# EAGLE schematic M240X (EAGLE 6.6.0)
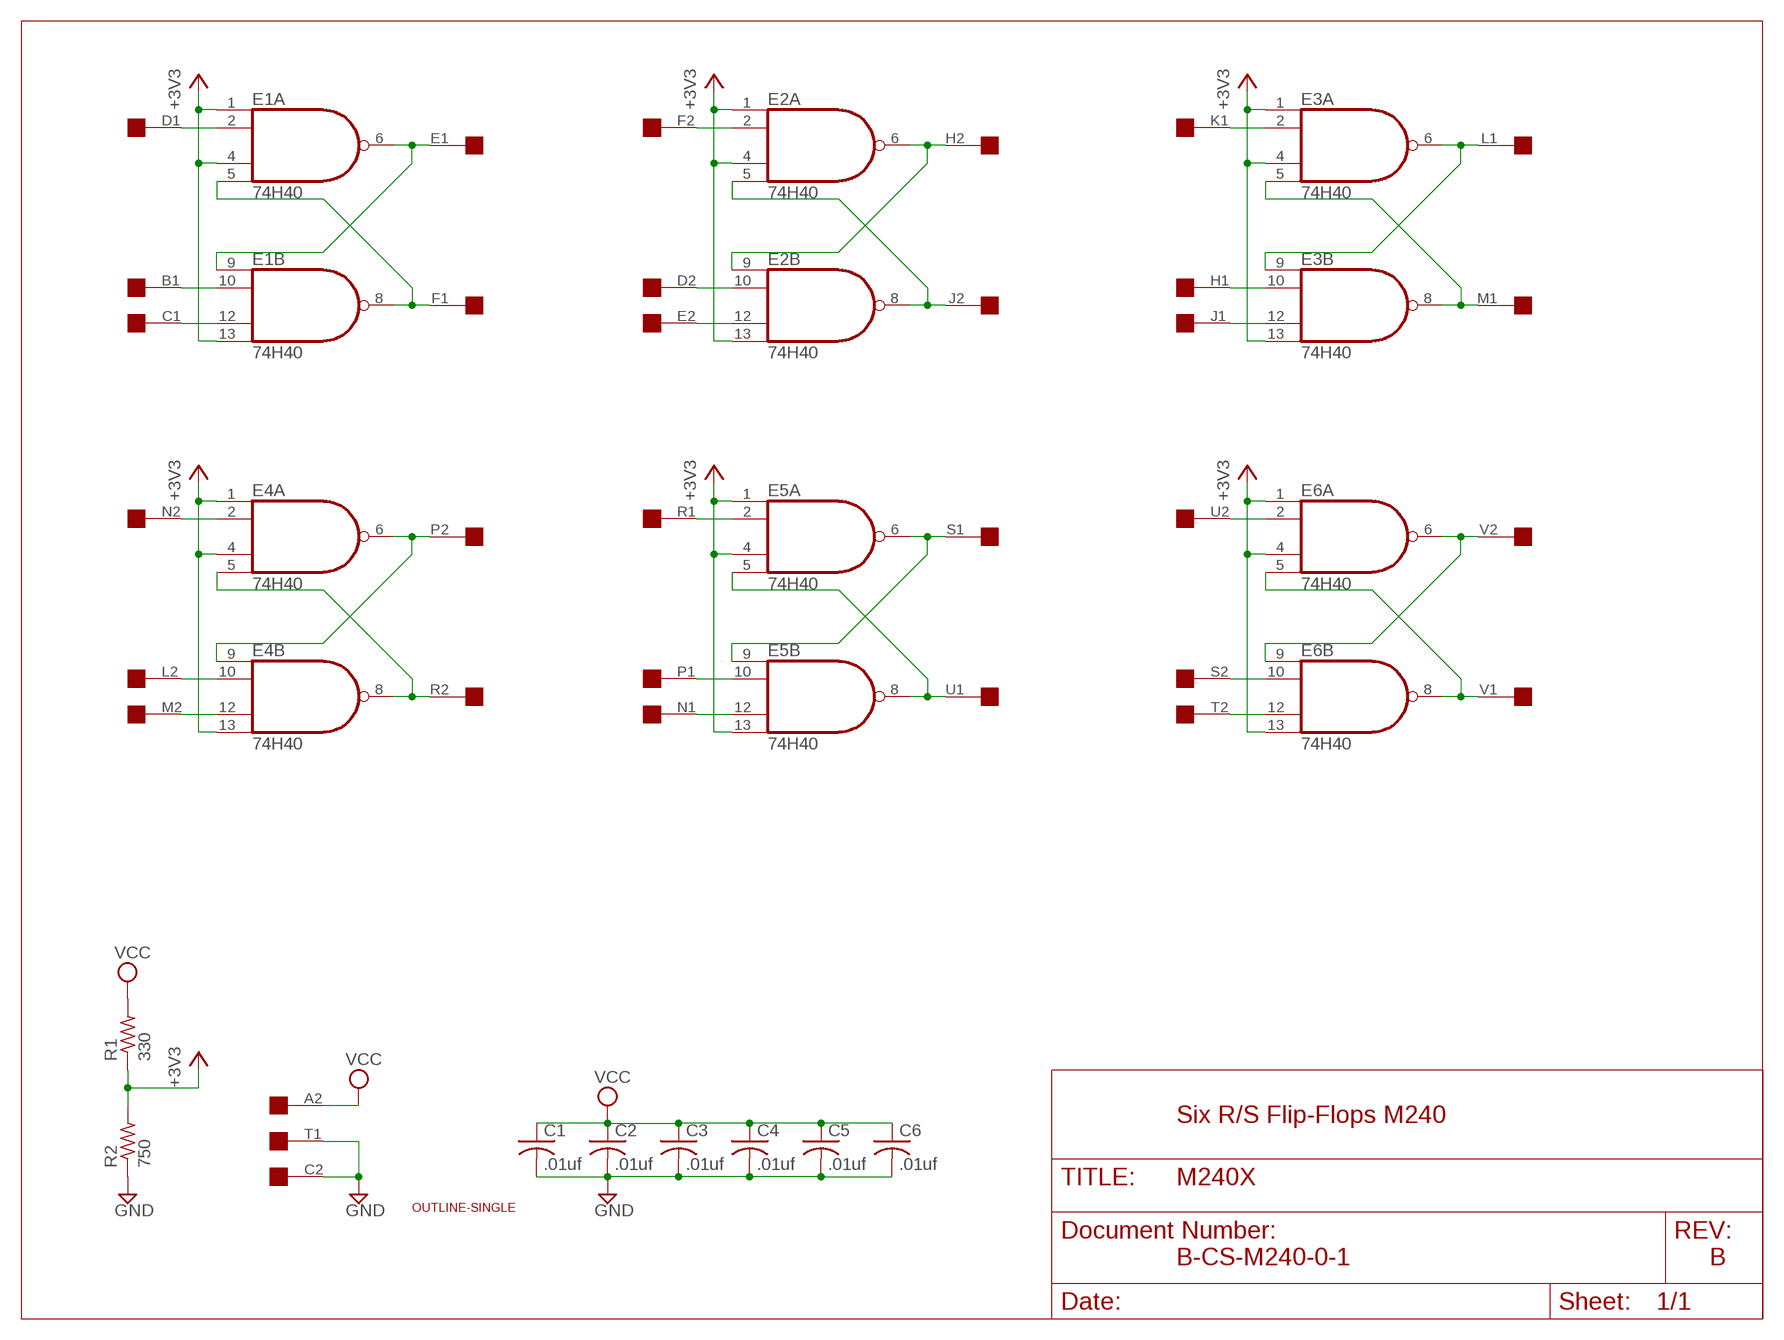
[diagram p0: schematic, sheet 1]

## Parts
C1  .01uf  C-US050-025X075  [C050-025X075]
C2  .01uf  C-US050-025X075  [C050-025X075]
C3  .01uf  C-US050-025X075  [C050-025X075]
C4  .01uf  C-US050-025X075  [C050-025X075]
C5  .01uf  C-US050-025X075  [C050-025X075]
C6  .01uf  C-US050-025X075  [C050-025X075]
E1  74H40  74S20N  [DIL14]
E2  74H40  74S20N  [DIL14]
E3  74H40  74S20N  [DIL14]
E4  74H40  74S20N  [DIL14]
E5  74H40  74S20N  [DIL14]
E6  74H40  74S20N  [DIL14]
R1  330  R-US_0207/10  [0207/10]
R2  750  R-US_0207/10  [0207/10]
U$1  OUTLINE-SINGLE  [SINGLE]
U$4  SINGLE  [EDGE-CON2]

## Nets
+3V3: E1.1(A:I0) E1.4(A:I2) E1.13(B:I3) E2.1(A:I0) E2.4(A:I2) E2.13(B:I3) E3.1(A:I0) E3.4(A:I2) E3.13(B:I3) E4.1(A:I0) E4.4(A:I2) E4.13(B:I3) E5.1(A:I0) E5.4(A:I2) E5.13(B:I3) E6.1(A:I0) E6.4(A:I2) E6.13(B:I3) R1.1 R2.2
GND [Supply]: C1.2 C2.2 C3.2 C4.2 C5.2 C6.2 R2.1 U$4.C2 U$4.T1
N$14: E1.6(A:O) E1.9(B:I0) U$4.E1
N$41: E1.5(A:I3) E1.8(B:O) U$4.F1
N$43: E1.2(A:I1) U$4.D1
N$44: E1.10(B:I1) U$4.B1
N$45: E1.12(B:I2) U$4.C1
N$46: E2.6(A:O) E2.9(B:I0) U$4.H2
N$47: E2.5(A:I3) E2.8(B:O) U$4.J2
N$48: E2.2(A:I1) U$4.F2
N$49: E2.10(B:I1) U$4.D2
N$50: E2.12(B:I2) U$4.E2
N$51: E3.6(A:O) E3.9(B:I0) U$4.L1
N$52: E3.5(A:I3) E3.8(B:O) U$4.M1
N$53: E3.2(A:I1) U$4.K1
N$54: E3.10(B:I1) U$4.H1
N$55: E3.12(B:I2) U$4.J1
N$56: E4.6(A:O) E4.9(B:I0) U$4.P2
N$57: E4.5(A:I3) E4.8(B:O) U$4.R2
N$58: E4.2(A:I1) U$4.N2
N$59: E4.10(B:I1) U$4.L2
N$60: E4.12(B:I2) U$4.M2
N$61: E5.6(A:O) E5.9(B:I0) U$4.S1
N$62: E5.5(A:I3) E5.8(B:O) U$4.U1
N$63: E5.2(A:I1) U$4.R1
N$64: E5.10(B:I1) U$4.P1
N$65: E5.12(B:I2) U$4.N1
N$66: E6.6(A:O) E6.9(B:I0) U$4.V2
N$67: E6.5(A:I3) E6.8(B:O) U$4.V1
N$68: E6.2(A:I1) U$4.U2
N$69: E6.10(B:I1) U$4.S2
N$70: E6.12(B:I2) U$4.T2
VCC [Supply]: C1.1 C2.1 C3.1 C4.1 C5.1 C6.1 R1.2 U$4.A2
Unconnected: U$4.A1 U$4.B2 U$4.K2

## Notes on the sheet
- Six R/S Flip-Flops M240
- B-CS-M240-0-1 | B

## Power pins joined to a net without a drawn wire
GND: E1.7(P:GND) E2.7(P:GND) E3.7(P:GND) E4.7(P:GND) E5.7(P:GND) E6.7(P:GND)
VCC: E1.14(P:VCC) E2.14(P:VCC) E3.14(P:VCC) E4.14(P:VCC) E5.14(P:VCC) E6.14(P:VCC)

## Library data of the parts
C1-C6 = rcl:C-US: CAPACITOR, American symbol
E1-E6 = 74xx-us:74*20: Dual 4-input NAND gate
R1 R2 = rcl:R-US_: RESISTOR, American symbol
U$1 = dec-con:OUTLINE-*: Board outlines for DEC boards.
U$4 = dec-con:SINGLE: Single-Height DEC board

## Net classes
1 Supply: width 0.813 mm